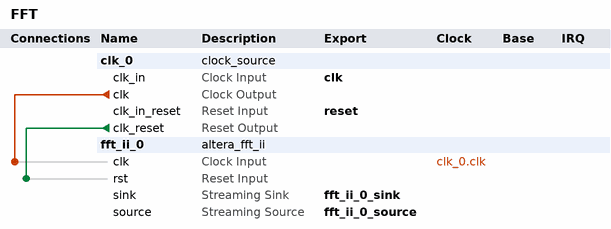
[diagram p0: system contents]
# Platform Designer (Qsys) system FFT, Cyclone V 5CSXFC6D6F31C6
# Parameters at their usual value, and those the tool derives, are not listed.
package require -exact qsys 20.1
create_system FFT
set_project_property DEVICE_FAMILY {Cyclone V}
set_project_property DEVICE 5CSXFC6D6F31C6

add_instance clk_0 clock_source 20.1
set_instance_parameter_value clk_0 clockFrequency 150000000

add_instance fft_ii_0 altera_fft_ii 20.1
set_instance_parameter_value fft_ii_0 data_flow {Variable Streaming}
set_instance_parameter_value fft_ii_0 data_rep {Fixed Point}
set_instance_parameter_value fft_ii_0 engine_arch {Quad Output}
set_instance_parameter_value fft_ii_0 in_width 14
set_instance_parameter_value fft_ii_0 length 16384
set_instance_parameter_value fft_ii_0 out_order {Digit Reverse}
set_instance_parameter_value fft_ii_0 out_width 29
set_instance_parameter_value fft_ii_0 twid_width 14

# connections
add_connection clk_0.clk fft_ii_0.clk clock
add_connection clk_0.clk_reset fft_ii_0.rst reset

# exported interfaces
add_interface clk clock sink
set_interface_property clk EXPORT_OF clk_0.clk_in
add_interface fft_ii_0_sink avalon_streaming sink
set_interface_property fft_ii_0_sink EXPORT_OF fft_ii_0.sink
add_interface fft_ii_0_source avalon_streaming source
set_interface_property fft_ii_0_source EXPORT_OF fft_ii_0.source
add_interface reset reset sink
set_interface_property reset EXPORT_OF clk_0.clk_in_reset

set_interconnect_requirement {$system} qsys_mm.clockCrossingAdapter HANDSHAKE
set_interconnect_requirement {$system} qsys_mm.enableEccProtection FALSE
set_interconnect_requirement {$system} qsys_mm.insertDefaultSlave FALSE
set_interconnect_requirement {$system} qsys_mm.maxAdditionalLatency 1

save_system FFT.qsys
